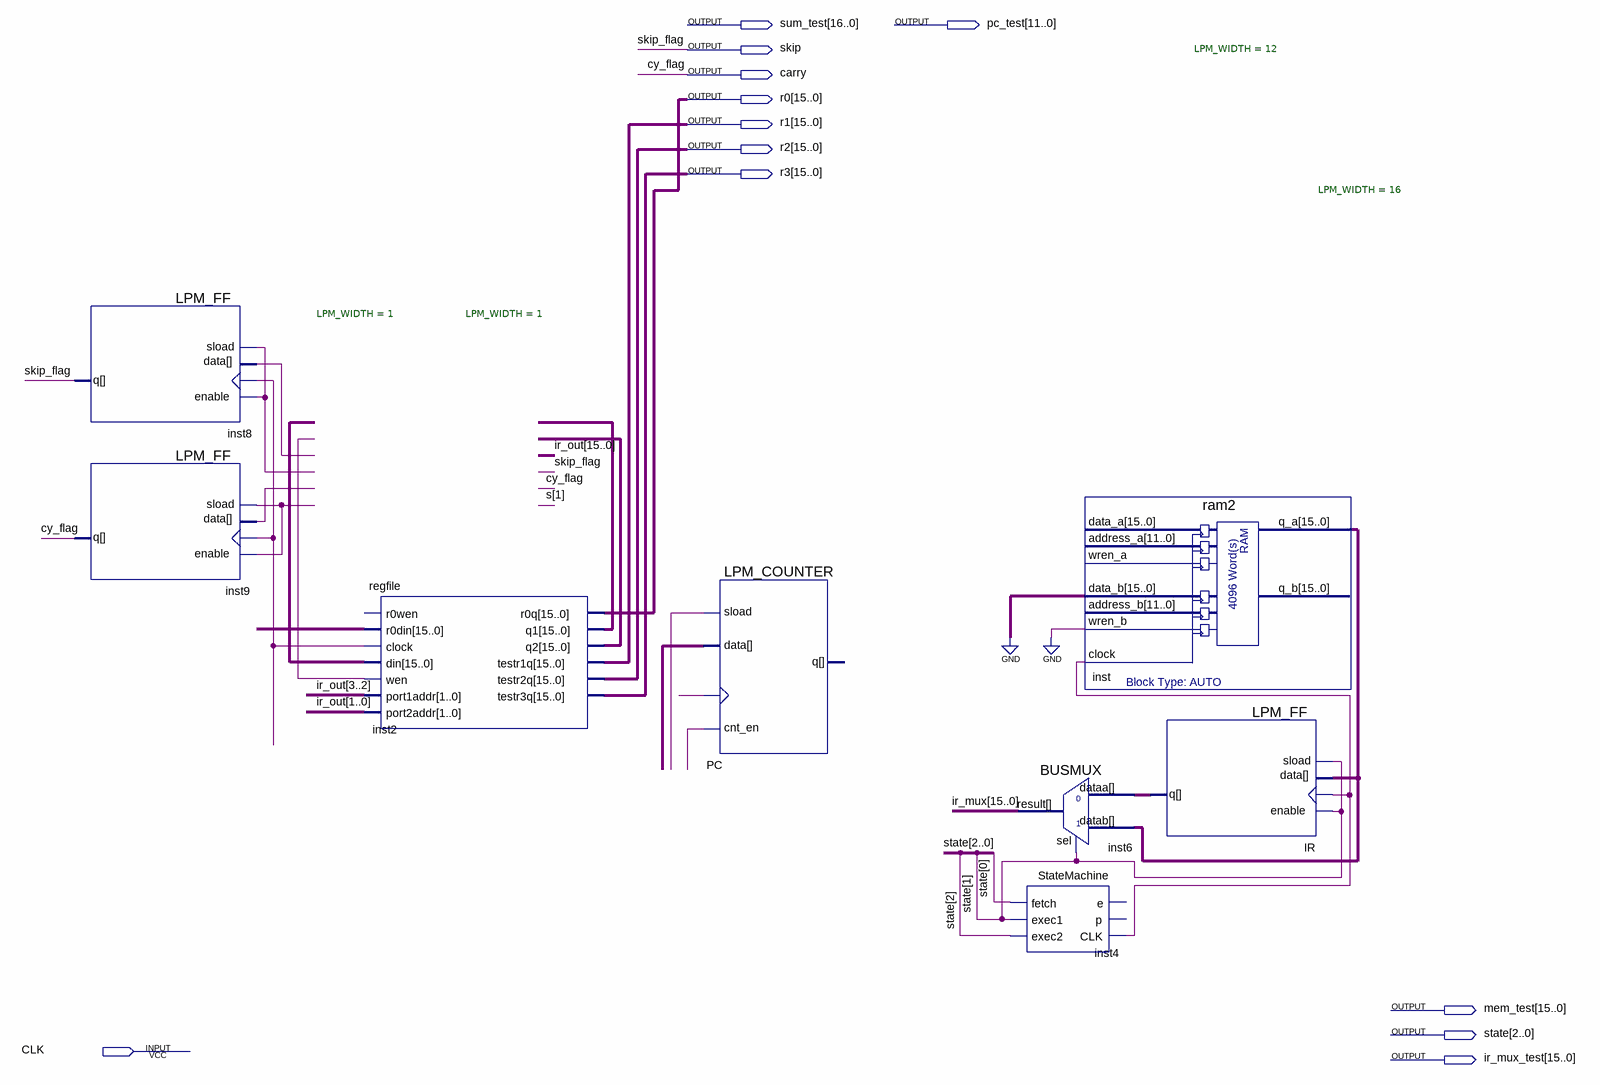
[diagram p0: schematic sheet]
// Quartus schematic GPGcpu.bdf as structural Verilog: 8 symbols, 12 pins
module GPGcpu (
  input  CLK,
  output [16:0] sum_test,
  output [11:0] pc_test,
  output skip,
  output carry,
  output [15:0] r0,
  output [15:0] r1,
  output [15:0] r2,
  output [15:0] r3,
  output [15:0] mem_test,
  output [2:0] state,
  output [15:0] ir_mux_test
);

  wire undriven, undriven_2, undriven_4, undriven_6, undriven_7, undriven_8, undriven_9, undriven_10,
       undriven_11, undriven_13;
  wire [3:0] ir_out;
  wire [11:0] undriven_3;
  wire [15:0] inst2_q1, inst2_q2, inst_q_a, ir_mux, IR_q, undriven_5, undriven_12;

  LPM_FF #(.LPM_WIDTH(1)) inst8 (
    .clock(undriven_11), .data(undriven_8), .enable(undriven_7), .sload(undriven_7), .q(skip));
  LPM_FF #(.LPM_WIDTH(1)) inst9 (
    .clock(undriven_11), .data(undriven_10), .enable(undriven_9), .sload(undriven_9), .q(carry));
  regfile inst2 (
    .r0din(undriven_12), .clock(undriven_11), .din(undriven_5), .wen(undriven_6), .port1addr(ir_out[3:2]),
    .port2addr(ir_out[1:0]), .r0q(r0), .q1(inst2_q1), .q2(inst2_q2), .testr1q(r1), .testr2q(r2), .testr3q(r3));  // open: r0wen
  LPM_COUNTER #(.LPM_WIDTH(12)) PC (
    .clock(undriven), .cnt_en(undriven_2), .data(undriven_3), .sload(undriven_4));  // open: q
  BUSMUX inst6 (.datab(inst_q_a), .sel(state[1]), .dataa(IR_q), .result(ir_mux));
  StateMachine inst4 (.CLK(undriven_13), .fetch(state[0]), .exec1(state[1]), .exec2(state[2]));  // open: e, p
  ram2 inst (
    .data_b({16{1'b0}}), .wren_b(1'b0), .clock(undriven_13), .q_a(inst_q_a));  // open: data_a, address_a, wren_a, address_b, q_b
  LPM_FF #(.LPM_WIDTH(16)) IR (.clock(undriven_13), .data(inst_q_a), .enable(state[1]), .sload(state[1]), .q(IR_q));

  // Other names for the same wires on the sheet: cy_flag = carry; skip_flag = skip
endmodule
